# EAGLE schematic Project_Sample_Name_1_0 (EAGLE 6.6.0)
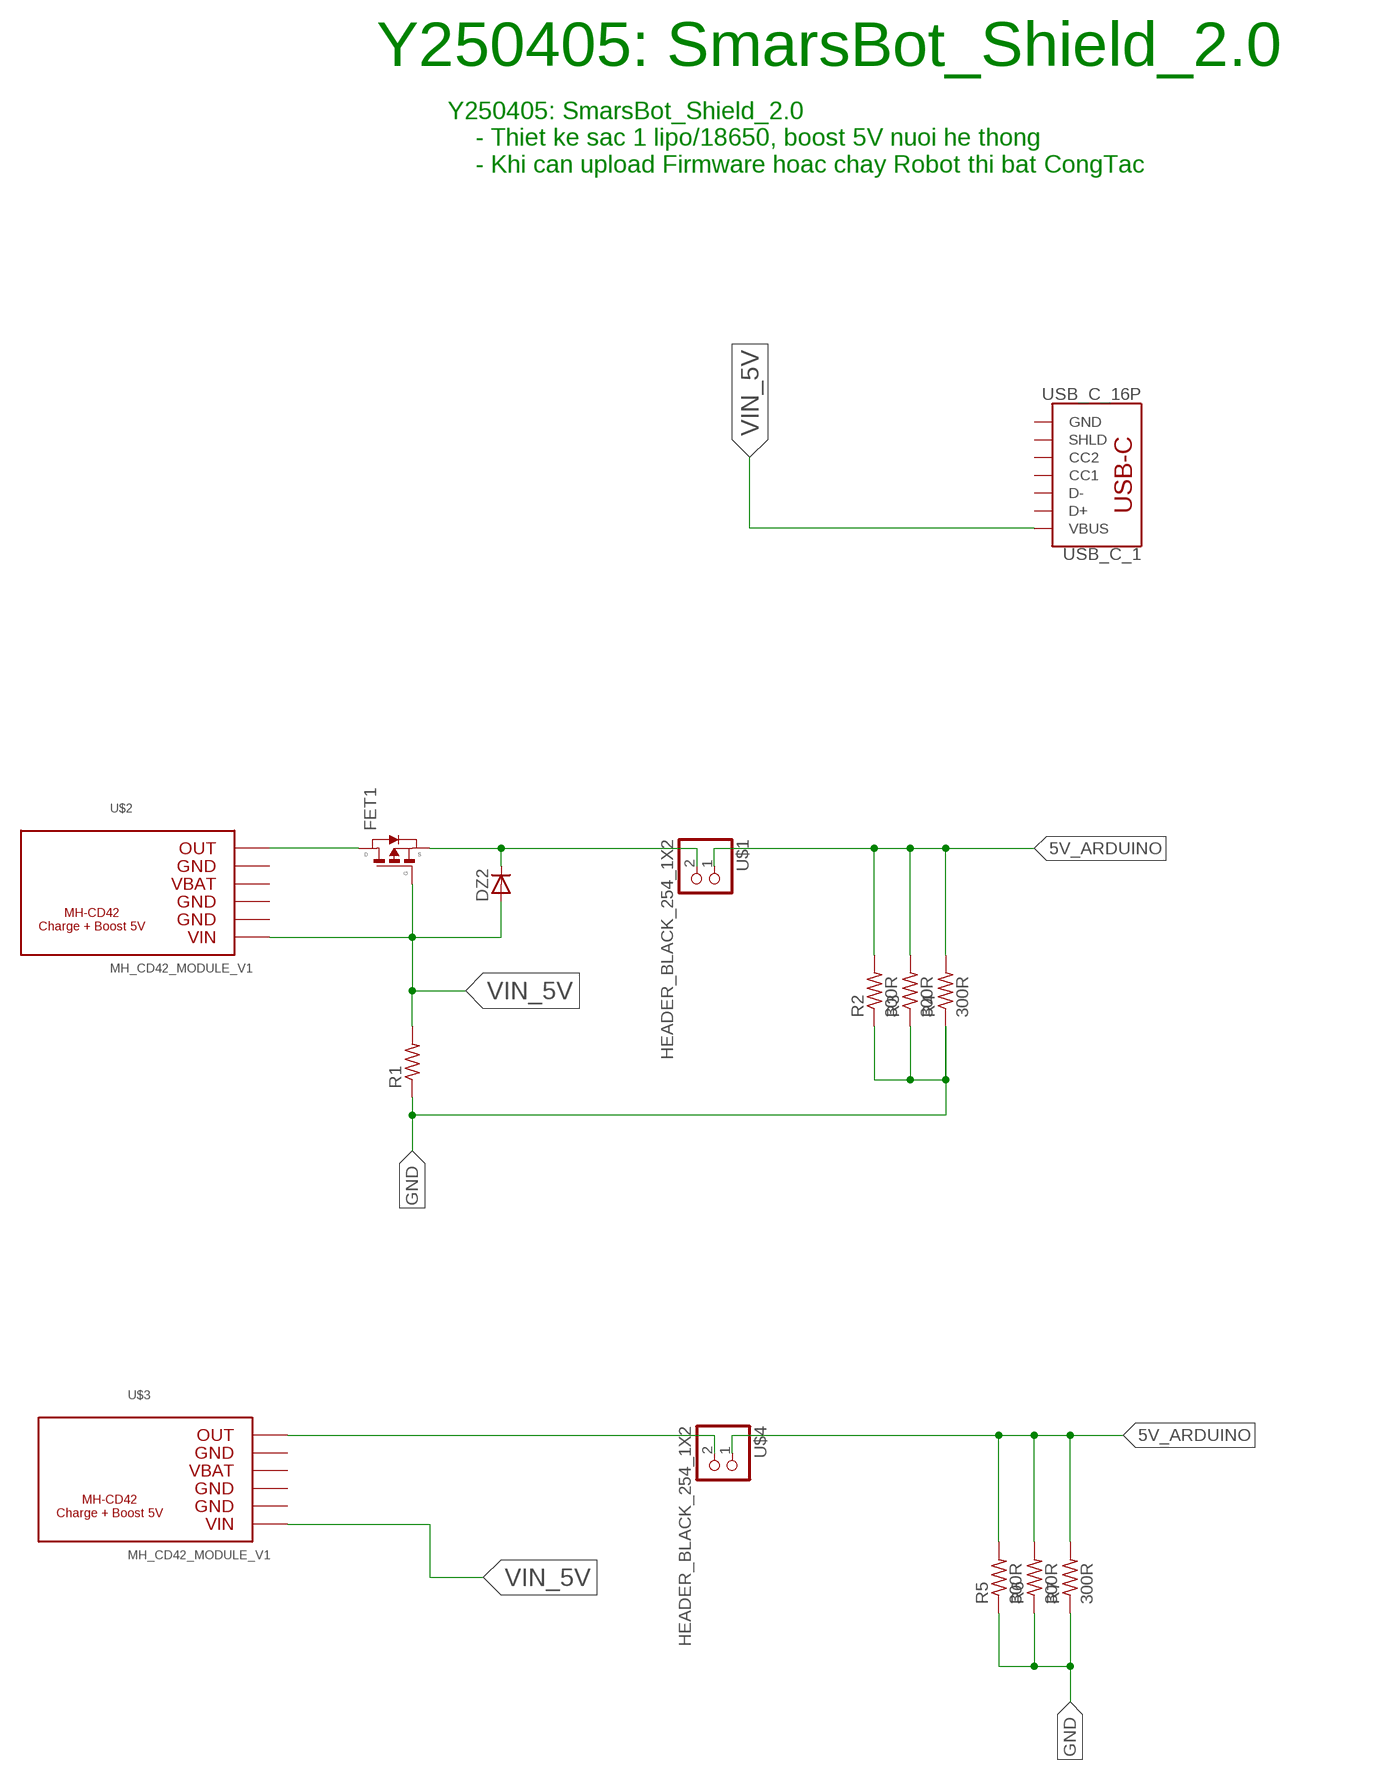
[diagram p0: schematic, sheet 1]

## Parts
DZ2  KAYO_DIOD_SS34SMA  [SMA]
FET1  KAYO_FET_SI2301_SOT23_P  [SI2301]
R1  R-US_10K_R0603_KXN  [R0603_KXN]
R2  300R  R-US_300R_R0603_KXN  [R0603_KXN]
R3  300R  R-US_300R_R0603_KXN  [R0603_KXN]
R4  300R  R-US_300R_R0603_KXN  [R0603_KXN]
R5  300R  R-US_300R_R0603_KXN  [R0603_KXN]
R6  300R  R-US_300R_R0603_KXN  [R0603_KXN]
R7  300R  R-US_300R_R0603_KXN  [R0603_KXN]
U$1  HEADER_BLACK_254_1X2  KXN_HEADER_1X2_LOCK  [HEADER_1X2_254_LOCK]
U$2  MH_CD42_MODULE_V1  [MODULE_MH_CD42_V1]
U$3  MH_CD42_MODULE_V1  [MODULE_MH_CD42_V1]
U$4  HEADER_BLACK_254_1X2  KXN_HEADER_1X2_LOCK  [HEADER_1X2_254_LOCK]
USB_C_1  USB_C_16P  KXN-CONNECTORS_USB_C_2-LAYER_PADS_KXN  [KXN_SPARKFUN-CONNECTORS_USB-C-16P-2LAYER-PADS]

## Nets
5V_ARDUINO: R2.2 R3.2 R4.2 R5.2 R6.2 R7.2 U$1.1 U$4.1
GND: R1.1 R2.1 R3.1 R4.1 R5.1 R6.1 R7.1
N$1: U$3.6 U$4.2
N$5: DZ2.C FET1.S U$1.2
N$7: FET1.D U$2.6
VIN_5V: DZ2.A FET1.G R1.2 U$2.1 U$3.1 USB_C_1.VBUS1(VBUS) USB_C_1.VBUS2(VBUS)
Unconnected: U$2.2 U$2.3 U$2.4 U$2.5 U$3.2 U$3.3 U$3.4 U$3.5 USB_C_1.A5(CC1) USB_C_1.A6(D+) USB_C_1.A7(D-) USB_C_1.B5(CC2) USB_C_1.B6(D+) USB_C_1.B7(D-) USB_C_1.GND USB_C_1.GND2(GND) USB_C_1.P$1(GND) USB_C_1.P$2(GND) USB_C_1.P$3(GND) USB_C_1.P$4(GND) USB_C_1.SHLD1(SHLD) USB_C_1.SHLD2(SHLD) USB_C_1.SHLD3(SHLD) USB_C_1.SHLD4(SHLD)

## Notes on the sheet
- Y250405: SmarsBot_Shield_2.0
- Y250405: SmarsBot_Shield_2.0
      - Thiet ke sac 1 lipo/18650, boost 5V nuoi he thong
      - Khi can upload Firmware hoac chay Robot thi bat CongTac

## Library data of the parts
DZ2 = kxnStandard_diod:KAYO_DIOD: DIODE; INFO: DIOD SMA SS34; LINK_MH: https://banlinhkien.com/diode-ss34-3a-40v-sma-1n5822-ss34a-p6652165.html
FET1 = kxnStandard_fet:KAYO_FET_SI2301
R1 = kxnStandard_resistor:R-US_: RESISTOR, American symbol; INFO: R0603 10K 1%
R2-R7 = kxnStandard_resistor:R-US_: RESISTOR, American symbol; INFO: R0603 300R 1%
U$1 U$4 = kxnStandard_connector:KXN_HEADER_1X2
U$2 U$3 = kxn_Standard_module_ForTutorial:MH_CD42_MODULE
USB_C_1 = kxnStandard_connector:KXN-CONNECTORS_USB_C: USB Type C 16Pin Connector Super Speed pins not available on the 16-pin purely SMD connector so this part is best for USB 2.0 implementations. D1 and D2 are tied together enabling D+/- no matter which way the cable is plugged into the connector. The two channel configuration pins (CC1/2) are exposed. These are normally connected to ground via 5.1k resistors but can be reconfigured for high current/high power applications. **4-LAYER BOARD WARNING!!** If designing 4-layer board, make sure to select the variant _4-LAYER-ISOLATED. The linked footprint (USB-C-16-4LAYER-ISOLATED) includes some very necessary cutout polygons in the inner layers (2 and 15). This prevents the PTH mounting shield legs on the USB connector from electrically connecting any other polygons on the inner layers (usually VCC and GND).